# EAGLE design mp3 Breakout (EAGLE 6.3)
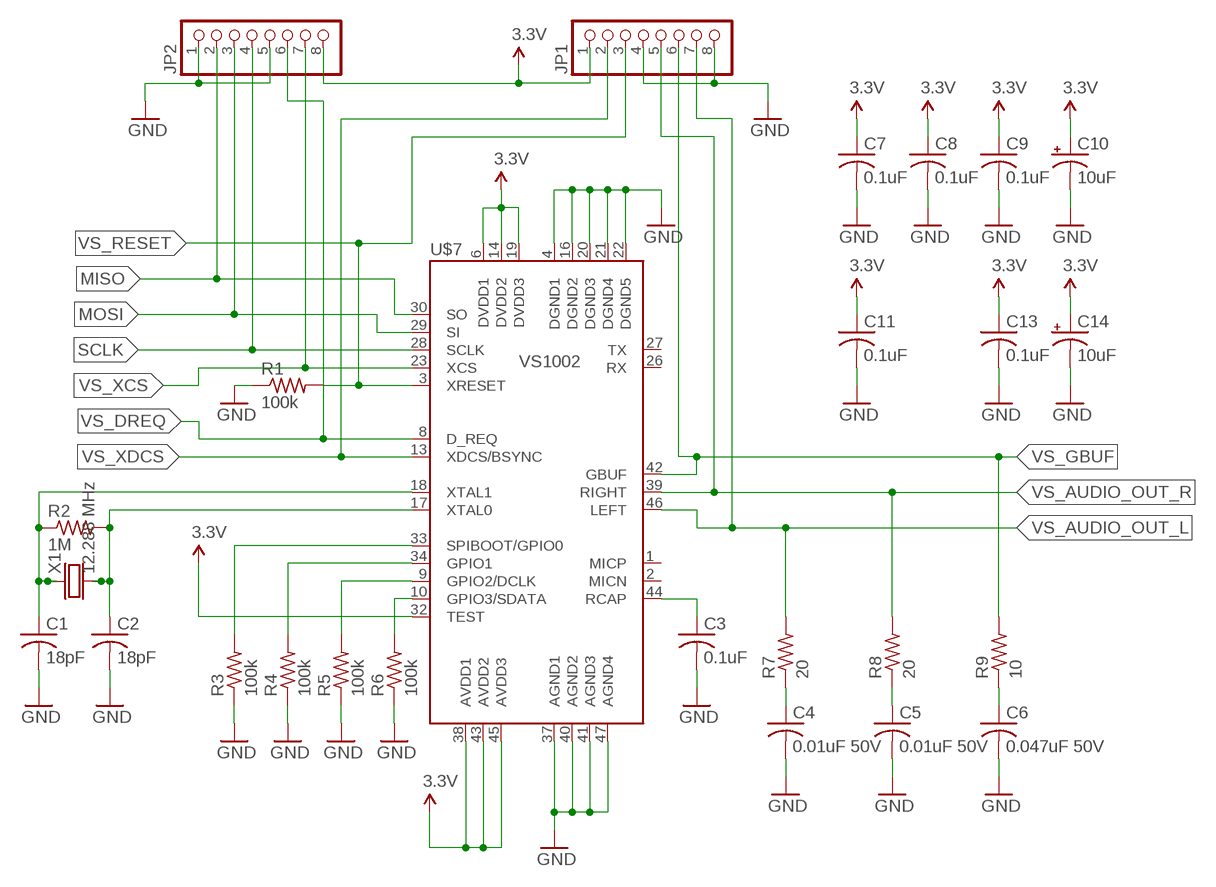
[diagram p0: schematic, sheet 1]

## Parts
C1  18pF  0603_CAP  [0603_RESISTOR]
C2  18pF  0603_CAP  [0603_RESISTOR]
C3  0.1uF  0603_CAP  [0603_RESISTOR]
C4  0.01uF 50V  0603_CAP  [0603_RESISTOR]
C5  0.01uF 50V  0603_CAP  [0603_RESISTOR]
C6  0.047uF 50V  0603_CAP  [0603_RESISTOR]
C7  0.1uF  0603_CAP  [0603_RESISTOR]
C8  0.1uF  0603_CAP  [0603_RESISTOR]
C9  0.1uF  0603_CAP  [0603_RESISTOR]
C10  10uF  CAP_POL_B  [CAP_B]
C11  0.1uF  0603_CAP  [0603_RESISTOR]
C13  0.1uF  0603_CAP  [0603_RESISTOR]
C14  10uF  CAP_POL_B  [CAP_B]
JP1  PINHD-1X8  [1X08]
JP2  PINHD-1X8  [1X08]
R1  100k  0603_RESISTOR  [0603_RESISTOR]
R2  1M  0603_RESISTOR  [0603_RESISTOR]
R3  100k  0603_RESISTOR  [0603_RESISTOR]
R4  100k  0603_RESISTOR  [0603_RESISTOR]
R5  100k  0603_RESISTOR  [0603_RESISTOR]
R6  100k  0603_RESISTOR  [0603_RESISTOR]
R7  20  0603_RESISTOR  [0603_RESISTOR]
R8  20  0603_RESISTOR  [0603_RESISTOR]
R9  10  0603_RESISTOR  [0603_RESISTOR]
U$7  VS1002  [LQFP-48]
X1  12.288 MHz  CRYSTAL_5X3  [CRYSTAL_5X3]

## Nets
3.3V: C7.1 C8.1 C9.1 C10.+ C11.1 C13.1 C14.+ JP1.1 JP2.8 U$7.6(DVDD1) U$7.14(DVDD2) U$7.19(DVDD3) U$7.32(TEST) U$7.38(AVDD1) U$7.43(AVDD2) U$7.45(AVDD3)
GND: C1.2 C2.2 C3.2 C4.2 C5.2 C6.2 C7.2 C8.2 C9.2 C10.- C11.2 C13.2 C14.- JP1.4 JP1.8 JP2.1 JP2.5 R1.1 R3.1 R4.1 R5.1 R6.1 U$7.4(DGND1) U$7.16(DGND2) U$7.20(DGND3) U$7.21(DGND4) U$7.22(DGND5) U$7.37(AGND1) U$7.40(AGND2) U$7.41(AGND3) U$7.47(AGND4)
MISO: JP2.2 U$7.30(SO)
MOSI: JP2.3 U$7.29(SI)
N$28: C1.1 R2.1 U$7.18(XTAL1) X1.1
N$29: C2.1 R2.2 U$7.17(XTAL0) X1.2
N$30: C3.1 U$7.44(RCAP)
N$32: R6.2 U$7.10(GPIO3/SDATA)
N$33: R5.2 U$7.9(GPIO2/DCLK)
N$34: R4.2 U$7.34(GPIO1)
N$35: R3.2 U$7.33(SPIBOOT/GPIO0)
N$41: C4.1 R7.1
N$42: C5.1 R8.1
N$43: C6.1 R9.1
SCLK: JP2.4 U$7.28(SCLK)
VS_AUDIO_OUT_L: JP1.7 R7.2 U$7.46(LEFT)
VS_AUDIO_OUT_R: JP1.5 R8.2 U$7.39(RIGHT)
VS_DREQ: JP2.6 U$7.8(D_REQ)
VS_GBUF: JP1.6 R9.2 U$7.42(GBUF)
VS_RESET: JP1.3 R1.2 U$7.3(XRESET)
VS_XCS: JP2.7 U$7.23(XCS)
VS_XDCS: JP1.2 U$7.13(XDCS/BSYNC)
Unconnected: U$7.1(MICP) U$7.2(MICN) U$7.26(RX) U$7.27(TX)

## Library data of the parts
C1-C9 C11 C13 = jkf-parts:0603_CAP: 0603 Capacitor
C10 C14 = jkf-parts:CAP_POL_B: Capacitor Panasonic size B
JP1 JP2 = pinhead:PINHD-1X8: PIN HEADER
R1-R9 = jkf-parts:0603_RESISTOR
U$7 = SparkFun-DigitalIC:VS1002: MP3 deecoder
X1 = jkf-parts:CRYSTAL_5X3: Crystal 5mm x 3mm

## Net classes
0 default: clearance 0.254 mm

## Board
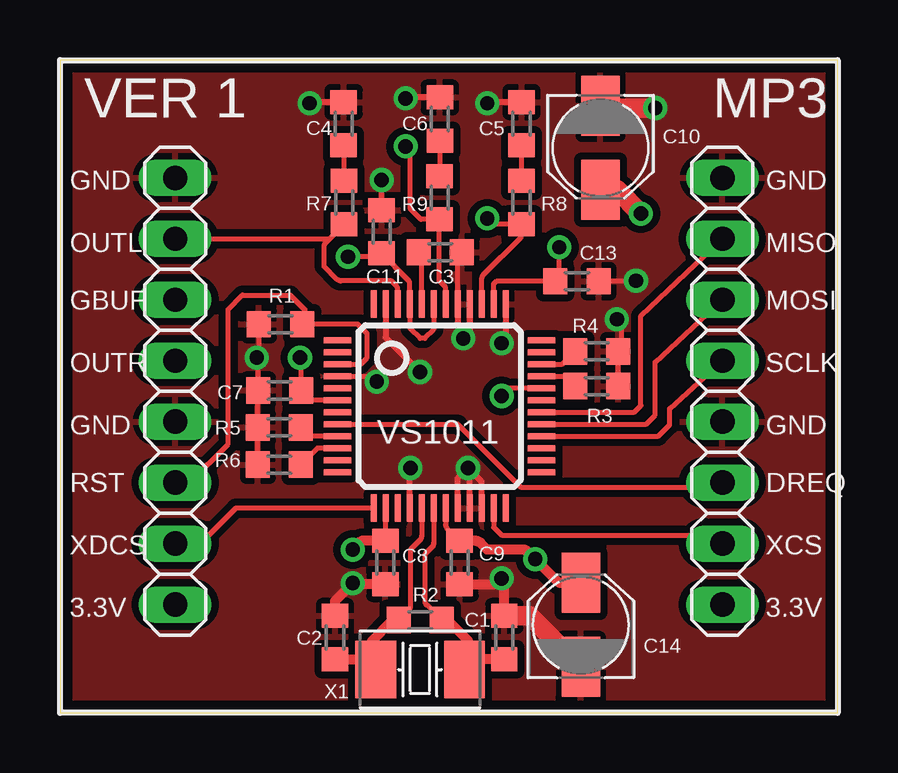
[diagram p1: board, top side]
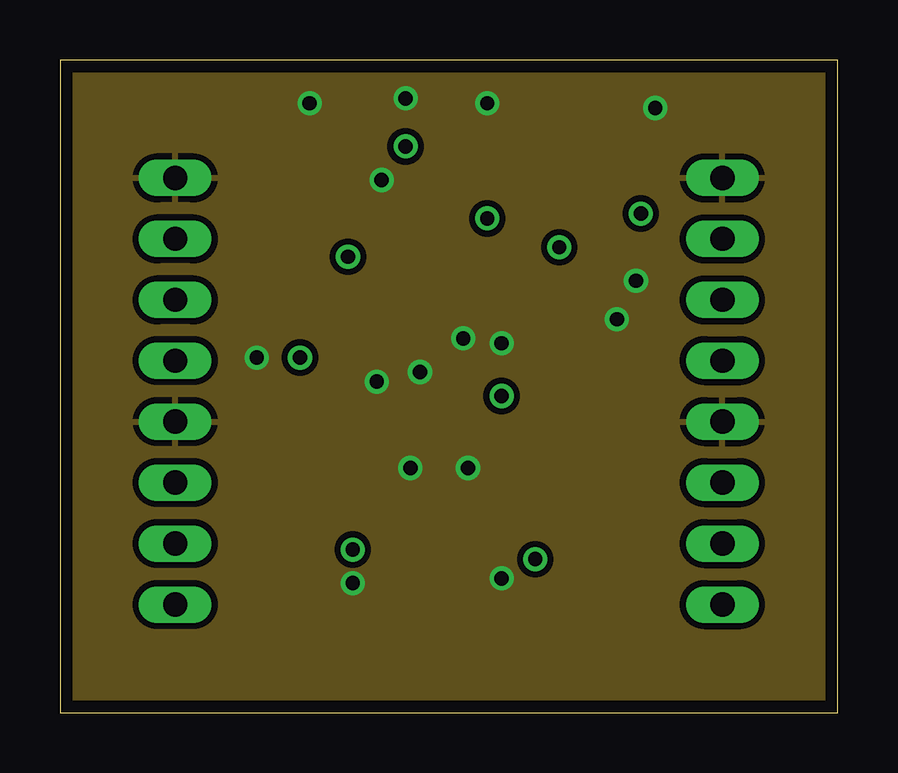
[diagram p2: board, inner layer GND]
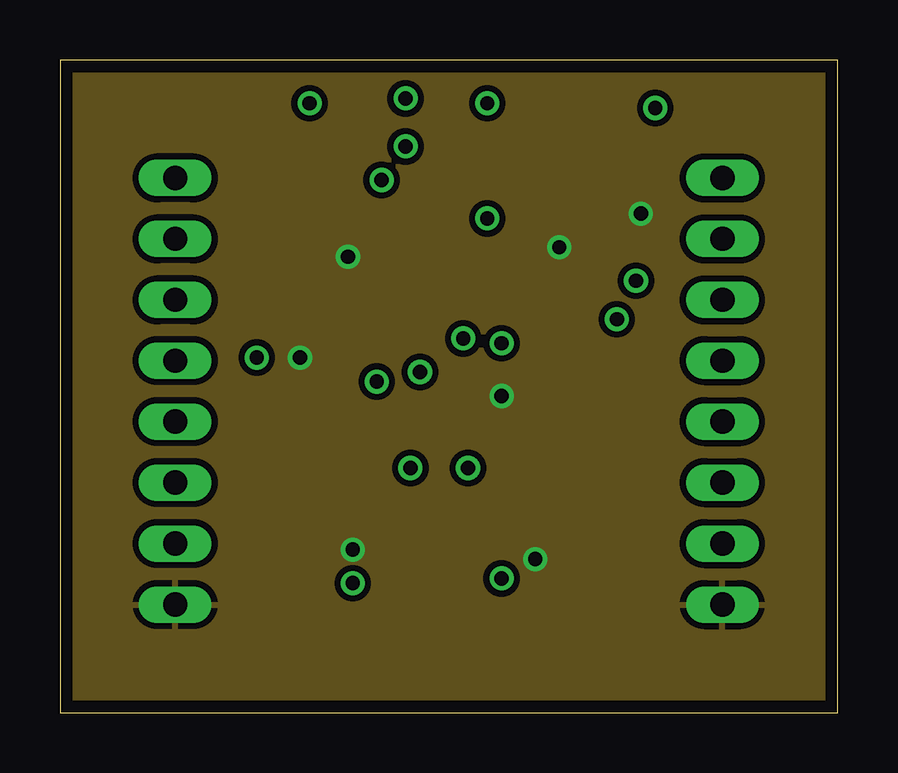
[diagram p3: board, inner layer 3.3V]
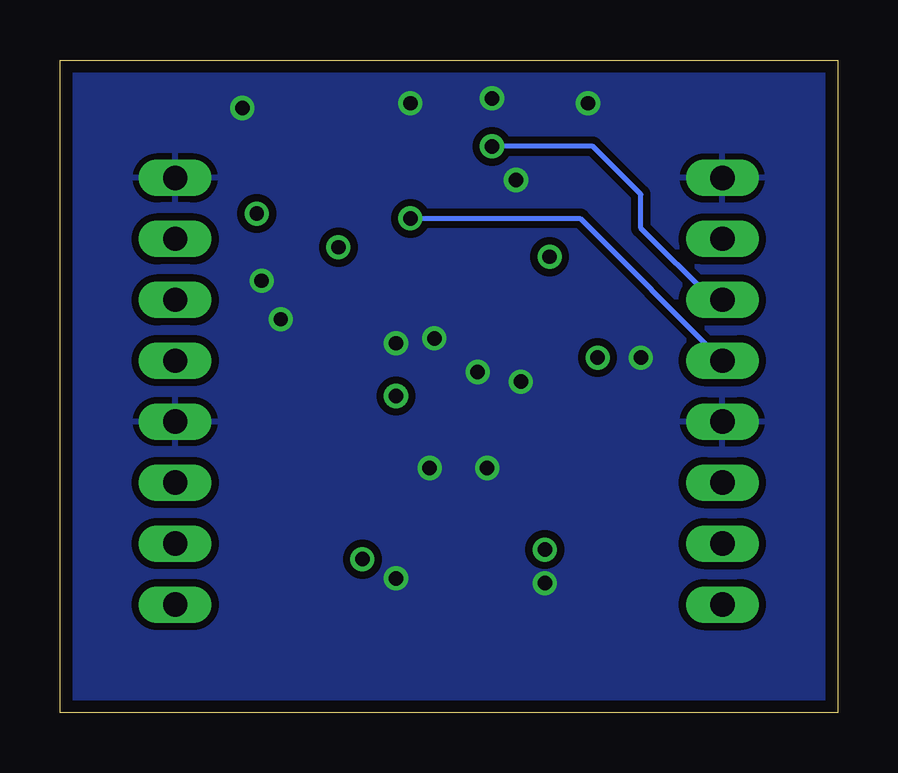
[diagram p4: board, bottom side, seen from below]

Size 32.4 x 27.2 mm. Coordinates in mm from the lower left corner, seen from the top.
Outline: 0,0 32.4,0 32.4,27.2 0,27.2 0,0
Copper layers (1+2*15+16): Top 0.0178mm / dielectric 12mil / GND 0.0356mm / dielectric 28mil / 3.3V 0.0356mm / dielectric 12mil / Bottom 0.0178mm
Design rules "SSC-EAGLE-4Lyr_v1.0.0.3": minimum track width 6mil, minimum drill 8mil, track to track 6mil, track to pad 6mil, pad to pad 6mil, via to via 6mil, smd to smd 6mil, copper to edge 20mil, drill to drill 16mil, minimum pad ring 8mil, minimum via ring 8mil, stop-mask expansion 3mil, vias tented up to drill 0mil, thermal gap 10mil

### Footprints (pad centres in the part's own frame; a part is rotated, then mirrored left to right if it is on the bottom)
0603_RESISTOR = smd 1 x 1.1: 1 -0.9,0; 2 0.9,0
CAP_B = smd 2.5 x 1.6: + 1.75,0; - -1.75,0
1X08 = drill 1.016 long: 1 -8.89,0; 2 -6.35,0; 3 -3.81,0; 4 -1.27,0; 5 1.27,0; 6 3.81,0; 7 6.35,0; 8 8.89,0
LQFP-48 = smd 0.254 x 1.143: 1 -2.75,-4.25; 2 -2.25,-4.25; 3 -1.75,-4.25; 4 -1.25,-4.25; 5 -0.75,-4.25; 6 -0.25,-4.25; 7 0.25,-4.25; 8 0.75,-4.25; 9 1.25,-4.25; 10 1.75,-4.25; 11 2.25,-4.25; 12 2.75,-4.25; 25 2.75,4.25; 26 2.25,4.25; 27 1.75,4.25; 28 1.25,4.25; 29 0.75,4.25; 30 0.25,4.25; 31 -0.25,4.25; 32 -0.75,4.25; 33 -1.25,4.25; 34 -1.75,4.25; 35 -2.25,4.25; 36 -2.75,4.25 | smd 1.143 x 0.254: 13 4.25,-2.75; 14 4.25,-2.25; 15 4.25,-1.75; 16 4.25,-1.25; 17 4.25,-0.75; 18 4.25,-0.25; 19 4.25,0.25; 20 4.25,0.75; 21 4.25,1.25; 22 4.25,1.75; 23 4.25,2.25; 24 4.25,2.75; 37 -4.25,2.75; 38 -4.25,2.25; 39 -4.25,1.75; 40 -4.25,1.25; 41 -4.25,0.75; 42 -4.25,0.25; 43 -4.25,-0.25; 44 -4.25,-0.75; 45 -4.25,-1.25; 46 -4.25,-1.75; 47 -4.25,-2.25; 48 -4.25,-2.75
CRYSTAL_5X3 = smd 1.7 x 2.4: 1 -1.85,0; 2 1.85,0

### Placement (x,y rotation side)
C1  18.51,3.14 90 top
C2  11.46,3.14 90 top
C3  15.84,19.19 0 top
C4  11.82,24.54 90 top
C5  19.23,24.54 90 top
C6  15.83,24.74 90 top
C7  9.16,13.43 180 top
C8  13.56,6.26 270 top
C9  16.65,6.26 270 top
C10  22.52,23.54 270 top
C11  13.4,20.04 90 top
C13  21.54,17.98 0 top
C14  21.7,3.66 90 top
JP1  4.8,13.4 90 top
JP2  27.6,13.4 270 top
R1  9.19,16.19 0 top
R2  15.01,3.86 180 top
R3  22.36,13.61 180 top
R4  22.36,15.06 180 top
R5  9.14,11.89 0 top
R6  9.14,10.34 0 top
R7  11.84,21.26 270 top
R8  19.23,21.26 270 top
R9  15.82,21.46 270 top
U$7  15.82,12.78 270 top
X1  15,1.8 180 top

### Tracks (layer width: path | path; a pad name or v marks a point on that pad's centre or on a via)
3.3V  (via drill 0.6)
  Top 0.203: U$7.14 C8.1 | U$7.32 18.73,13.53 v18.4,13.2 | U$7.6 10.46,13.03 C7.1 10.06,14.74 v10,14.8 | U$7.43 15.57,15.97 15.2,15.6 15,15.6 14.6,16 14.6,17 U$7.45 14.57,17.86 arc45 14.5,18.04 C11.1 13.34,19 v12,19 | U$7.38 18.07,17.87 18.2,18 20.2,18 arc45 20.25,17.98 C13.1 20.73,18.07 arc45 20.8,18.25 v20.8,19.4 | U$7.19 16.07,7.84 arc45 16.14,7.67 C9.1
  Top 0.406: v12.2,6.8 12.56,7.16 C8.1 | 21.52,5.48 arc45 C14.+ 20.89,5.41 arc-45 20.72,5.48 v19.8,6.4 19.47,6.73 arc45 19.3,6.8 17.8,6.8 17.51,7.09 arc45 17.34,7.16 C9.1
  Top 0.813: C10.+ 23.21,21.79 v24.2,20.8
  pour 3.3V: 0,27.2 32.4,27.2 32.4,0 0,0
GND  (via drill 0.6)
  Top 0.203: R6.1 R5.1 8.24,13.41 C7.2 8.26,14.74 v8.2,14.8 | v8.19,14.81 v8.2,14.8 | R1.1 8.29,14.89 v8.2,14.8 | U$7.4 12.87,14.03 arc-45 13.04,13.96 v13.2,13.8 | U$7.41 16.57,18.91 arc-45 16.64,19.09 C3.2 | C11.2 v13.4,22.2 | C13.2 arc-45 22.49,18 v24,18 | R3.1 R4.1 | 23.4,15.06 23.4,16.2 v23.2,16.4
  Top 0.254: U$7.16 14.57,10.17 v14.6,10.2 | U$7.21 17.07,10.13 v17,10.2 | U$7.20 16.57,9.77 v17,10.2 | U$7.22 17.57,9.63 v17,10.2 | U$7.37 18.57,15.57 v18.4,15.4 | U$7.40 17.07,15.87 v16.8,15.6 16.57,15.83 U$7.41 | U$7.47 13.57,15.63 v15,14.2 | C5.2 17.8,25.44 v17.8,25.4 | C6.2 14.4,25.64 v14.4,25.6 | C4.2 10.4,25.44 v10.4,25.4
  Top 0.406: C2.2 11.46,4.66 v12.2,5.4 12.24,5.36 C8.2 | C9.2 18.05,5.36 arc45 18.23,5.43 v18.4,5.6 18.44,5.56 arc-45 18.51,5.38 C1.2 | R4.1 23.4,15.06
  Top 0.813: C1.2 19.57,4.04 C14.- | 22.52,25.32 C10.- 22.52,25.2 v24.8,25.2
  pour Top (isolate 0.305): 0,27.2 32.4,27.2 32.4,0 0,0
  pour GND: 0,27.2 32.4,27.2 32.4,0 0,0
  pour Bottom (isolate 0.305): 0,27.2 32.4,27.2 32.4,0 0,0
MISO
  Top 0.203: U$7.30 23.93,12.53 24.2,12.8 24.2,16.55 JP2.2
MOSI
  Top 0.203: U$7.29 24.43,12.03 24.8,12.4 24.8,14.61 JP2.3
N$28
  Top 0.203: U$7.18 15.57,7.08 arc-45 15.5,6.9 15.2,6.6 15.2,4.67 arc45 15.27,4.5 R2.1
  Top 0.406: R2.1 16.04,3.86 arc-45 16.21,3.79 17,3 17,2.06 arc-45 16.93,1.88 X1.1 17.22,2.17 arc-45 17.39,2.24 C1.1
N$29
  Top 0.203: U$7.17 15.07,7.38 arc-45 15,7.2 14.6,6.8 14.6,4.46 arc-45 14.53,4.28 R2.2
  Top 0.406: R2.2 13.96,3.86 arc45 13.79,3.79 13,3 13,2.06 arc45 13.07,1.88 X1.2 12.78,2.17 arc45 12.61,2.24 C2.1
N$30
  Top 0.203: U$7.44 15.07,18.95 arc45 15,19.13 C3.1
N$32
  Top 0.203: U$7.10 10.73,11.03 R6.2
N$33
  Top 0.203: U$7.9 10.4,11.53 R5.2
N$34
  Top 0.203: U$7.34 20.93,14.53 R4.2
N$35
  Top 0.203: U$7.33 21.04,14.03 R3.2
N$41
  Top 0.203: R7.1 11.84,23.62 C4.1
N$42
  Top 0.203: R8.1 C5.1
N$43
  Top 0.203: C6.1 15.82,23.63 R9.1
SCLK
  Top 0.203: U$7.28 24.93,11.53 25.4,12 25.4,12.67 JP2.4
VS_AUDIO_OUT_L
  Top 0.203: U$7.46 14.07,17.62 arc45 14,17.8 13.8,18 11.71,18 arc-45 11.53,18.07 11,18.6 11,19.41 arc-45 11.07,19.59 R7.2 11.23,19.75 JP1.7
VS_AUDIO_OUT_R  (via drill 0.6)
  Top 0.203: U$7.39 17.57,18.07 arc-45 17.64,18.24 19.2,19.8 19.2,20.29 arc-45 R8.2 18.04,20.36 v17.8,20.6
  Bottom 0.203: v17.8,20.6 10.73,20.6 JP1.5
VS_DREQ
  Top 0.203: U$7.8 16.57,12.03 19.2,9.4 27.21,9.4 JP2.6
VS_GBUF  (via drill 0.6)
  Top 0.203: U$7.42 16.07,17.73 15.8,18 15.8,20.54 R9.2 15.04,20.56 14.6,21 14.6,23.4 v14.4,23.6
  Bottom 0.203: JP1.6 5.21,17.21 8.2,20.2 8.2,21.6 10.2,23.6 v14.4,23.6
VS_RESET
  Top 0.203: U$7.3 12.53,14.53 12.8,14.8 12.8,15.8 12.4,16.2 R1.2 10.2,16.3 10.2,16.8 9.6,17.4 7.6,17.4 7,16.8 7,11.2 5.39,9.59 JP1.3
VS_XCS
  Top 0.203: U$7.23 18.07,7.73 18.4,7.4 27.05,7.4 JP2.7
VS_XDCS
  Top 0.203: U$7.13 7.33,8.53 5.8,7 4.85,7 JP1.2

### Text on the board
tPlace: VER 1 | MP3 | VS1011
tSilk: GND | GND | OUTL | MISO | GBUF | MOSI | OUTR | SCLK | GND | GND | RST | DREQ | XDCS | XCS | 3.3V | 3.3V